# Altium schematic sheet Debug_Interface.SchDoc: Debug Interface
size A4; Author: Thomas Carrington; DocumentNumber: 6; Revision: 1.1; SheetNumber: 6; SheetTotal: 8
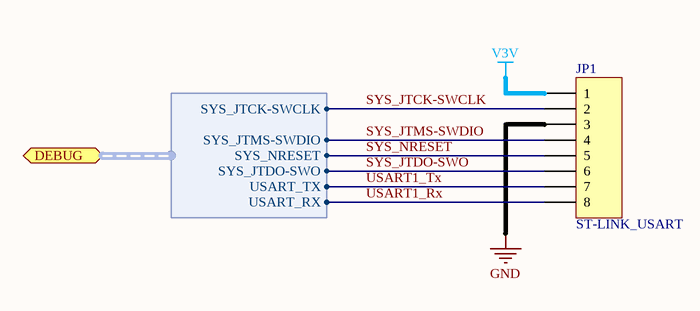
[diagram p0: Debug_Interface.SchDoc]

## Parts
JP1  ST-LINK_USART  [MHDR1X8]

## Ports
DEBUG (harness Debug_Harness)

## Harnesses
Debug_Harness: SYS_JTCK-SWCLK, SYS_JTDO-SWO, SYS_JTMS-SWDIO, SYS_NRESET, USART_RX, USART_TX

## Nets
GND: JP1.3
V3V: JP1.1
SYS_JTCK-SWCLK: JP1.2 ; port DEBUG.SYS_JTCK-SWCLK
SYS_JTDO-SWO: JP1.6 ; port DEBUG.SYS_JTDO-SWO
SYS_JTMS-SWDIO: JP1.4 ; port DEBUG.SYS_JTMS-SWDIO
SYS_NRESET: JP1.5 ; port DEBUG.SYS_NRESET
USART1_Rx: JP1.8 ; port DEBUG.USART_RX
USART1_Tx: JP1.7 ; port DEBUG.USART_TX

## Notes on the sheet
- Title
- Size:
- Date:
- A4
- Number:
- Time:
- Revision:
- Sheet
- of
- File:

## Library data of the parts
JP1 = MHDR1X8: Header, 8-Pin; LatestRevisionDate: 17-Jul-2002; LatestRevisionNote: Re-released for DXP Platform.; Publisher: Altium Limited